# Altium schematic sheet SENSOR_PB.SchDoc
size A4; SheetNumber: 5; SheetTotal: 5
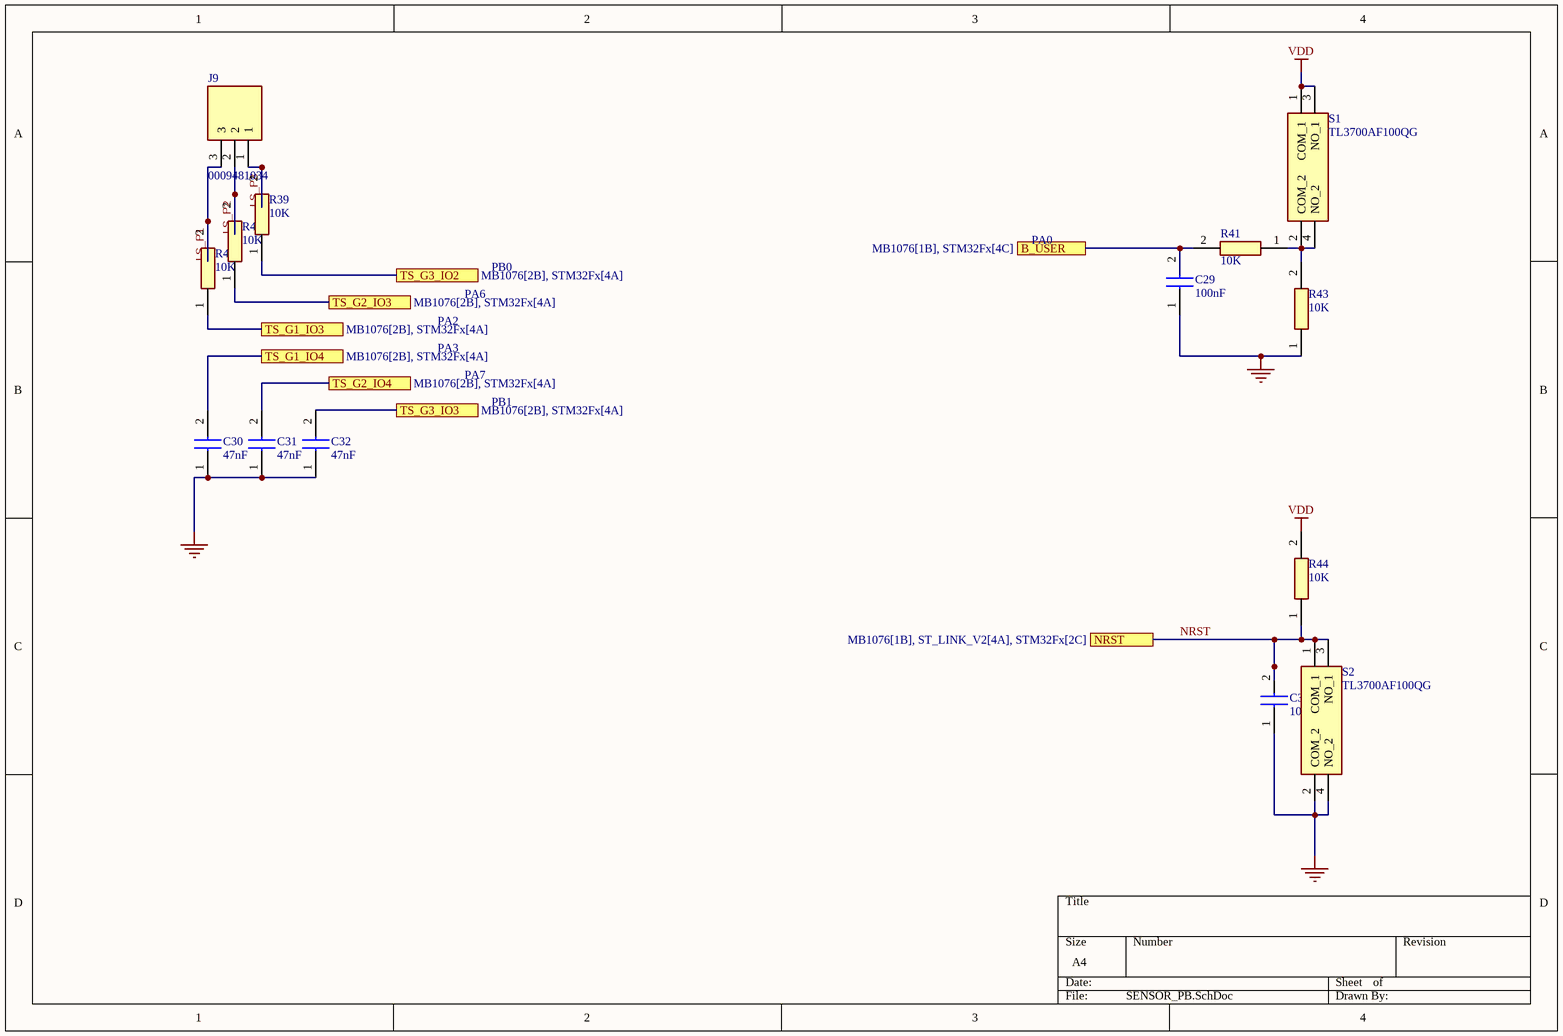
[diagram p0: SENSOR_PB.SchDoc]

## Parts
C29  100nF  [ECHU_J1_J2_17_21]
C30  47nF  [ECHU_J1_J2_17_21]
C31  47nF  [ECHU_J1_J2_17_21]
C32  47nF  [ECHU_J1_J2_17_21]
C33  100nF  [ECHU_J1_J2_17_21]
J9  0009481034  [0009481034]
R39  10K  [RESC2012X60N]
R40  10K  [RESC2012X60N]
R41  10K  [RESC2012X60N]
R42  10K  [RESC2012X60N]
R43  10K  [RESC2012X60N]
R44  10K  [RESC2012X60N]
S1  TL3700AF100QG  [TL3700AF100QG]
S2  TL3700AF100QG  [TL3700AF100QG]

## Ports
B_USER (see MB1076[1B], STM32Fx[4C]), NRST (see MB1076[1B], ST_LINK_V2[4A], STM32Fx[2C]), TS_G1_IO3 (see MB1076[2B], STM32Fx[4A]), TS_G1_IO4 (see MB1076[2B], STM32Fx[4A]), TS_G2_IO3 (see MB1076[2B], STM32Fx[4A]), TS_G2_IO4 (see MB1076[2B], STM32Fx[4A]), TS_G3_IO2 (see MB1076[2B], STM32Fx[4A]), TS_G3_IO3 (see MB1076[2B], STM32Fx[4A])

## Nets
GND: C29.1 C30.1 C31.1 C32.1 C33.1 R43.1 S2.2(COM_2) S2.4(NO_2)
VDD: R44.2 S1.1(COM_1) S1.3(NO_1)
B_USER: C29.2 R41.2 ; port B_USER
LS_P1: J9.3 R42.2
LS_P2: J9.2 R40.2
LS_P3: J9.1 R39.2
NRST: C33.2 R44.1 S2.1(COM_1) S2.3(NO_1) ; port NRST
TS_G1_IO3: R42.1 ; port TS_G1_IO3
TS_G1_IO4: C30.2 ; port TS_G1_IO4
TS_G2_IO3: R40.1 ; port TS_G2_IO3
TS_G2_IO4: C31.2 ; port TS_G2_IO4
TS_G3_IO2: R39.1 ; port TS_G3_IO2
TS_G3_IO3: C32.2 ; port TS_G3_IO3
NetR41_1: R41.1 R43.2 S1.2(COM_2) S1.4(NO_2)

## Notes on the sheet
- PA0
- PA6
- PB0
- PA2
- PA3
- PA7
- PB1

## Library data of the parts
C29-C33 = ECH-U1H102GX5: Capacitor; Manufacturer_Name: Panasonic; Datasheet Link: http://industrial.panasonic.com/cdbs/www-data/pdf/RDI0000/ABD0000C173.pdf; Manufacturer_Part_Number: ECH-U1H102GX5; Mouser Part Number: 667-ECH-U1H102GX5; Mouser Price/Stock: https://www.mouser.co.uk/ProductDetail/Panasonic/ECH-U1H102GX5?qs=DWeLBnRir%2FIlo4Nc0F6AmQ%3D%3D; Arrow Part Number: ECH-U1H102GX5; Arrow Price/Stock: https://www.arrow.com/en/products/echu1h102gx5/panasonic?region=europe
J9 = 0009481034: Connector; Manufacturer_Name: Molex; Datasheet Link: https://www.molex.com/pdm_docs/sd/009481034_sd.pdf; Height: 12.17mm; Manufacturer_Part_Number: 0009481034; Mouser Part Number: N/A; Mouser Price/Stock: https://www.mouser.co.uk/ProductDetail/Molex/0009481034?qs=kF4zOt4%2FK7VvgYpahOC8cQ%3D%3D; Arrow Part Number: 0009481034; Arrow Price/Stock: https://www.arrow.com/en/products/0009481034/molex?region=europe
R39-R44 = RK73H2ATTD5111F: Resistor; Manufacturer_Name: KOA Speer; Datasheet Link: http://www.koaspeer.com/catimages/Products/RK73H/RK73H.pdf; Height: 0.6mm; Manufacturer_Part_Number: RK73H2ATTD5111F
S1 S2 = TL3700AF100QG: Switch; Manufacturer_Name: E-Switch; Datasheet Link: https://componentsearchengine.com/Datasheets/2/TL3700AF100QG.pdf; Height: 0.65mm; Manufacturer_Part_Number: TL3700AF100QG; Mouser Part Number: 612-TL3700AF100QG; Mouser Price/Stock: https://www.mouser.co.uk/ProductDetail/E-Switch/Tl3700AF100QG?qs=RgNsNAib%252BebCEEByNU3OOQ%3D%3D